# Altium project Mic2_WISP.PrjPCB
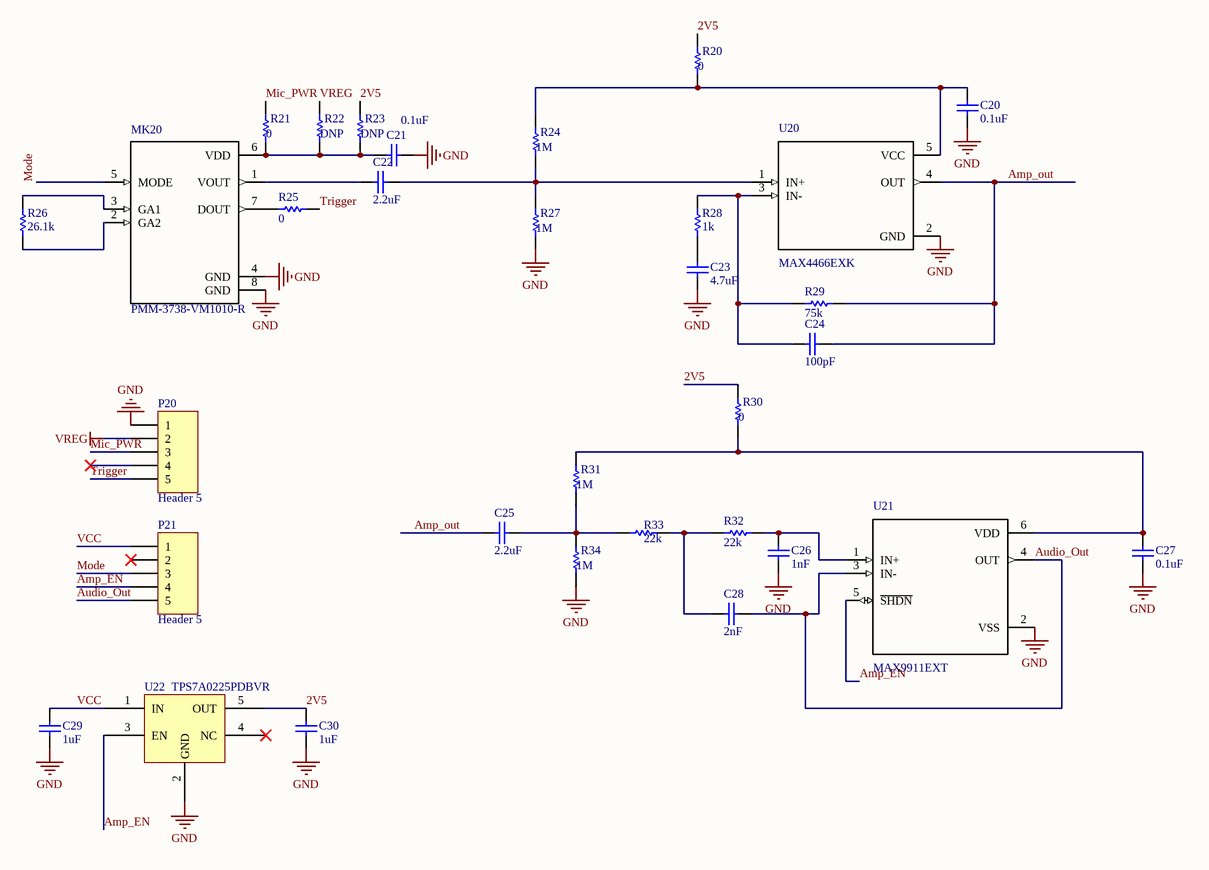
[diagram p0: Microphone2.SchDoc]
1 sheet, 32 parts. Net scope: global (net labels, ports and power ports of the same name join across sheets).
Board file: Microphone2.PcbDoc

## Sheet Microphone2.SchDoc: Microphone
size Letter; Author: Ali Saffari; Organization: University of Washinton; Address1: Sensor Systems Lab; Revision: 2; SheetNumber: 1; SheetTotal: 1

### Parts
C20  0.1uF  [0402]
C21  0.1uF  [0402]
C22  2.2uF  [0402]
C23  4.7uF  [0402]
C24  100pF  [0402]
C25  2.2uF  [0402]
C26  1nF  [0402]
C27  0.1uF  [0402]
C28  2nF  [0402]
C29  1uF  [0402]
C30  1uF  [0402]
MK20  PMM-3738-VM1010-R  [MIC_PMM-3738-VM1010-R]
P20  Header 5  [HDR1X5]
P21  Header 5  [HDR1X5]
R20  0  [0402]
R21  0  [0402]
R22  DNP  [0402]
R23  DNP  [0402]
R24  1M  [0402]
R25  0  [0402]
R26  26.1k  [0402]
R27  1M  [0402]
R28  1k  [0402]
R29  75k  [0402]
R30  0  [0402]
R31  1M  [0402]
R32  22k  [0402]
R33  22k  [0402]
R34  1M  [0402]
U20  MAX4466EXK  [SOT65P210X110-5N]
U21  MAX9911EXT  [MAX9911EXT]
U22  TPS7A0225PDBVR  [SOT23-5]

### Nets
GND: C20.2 C21.2 C23.1 C26.2 C27.1 C29.1 C30.1 MK20.4(GND) MK20.8(GND) P20.1 R27.2 R34.1 U20.2(GND) U21.2(VSS) U22.2(GND)
VREG: P20.2 R22.1
2V5: C30.2 R20.1 R23.1 R30.1 U22.5(OUT)
Amp_EN: P21.4 U21.5(~{SHDN}) U22.3(EN)
Amp_out: C24.1 C25.1 R29.2 U20.4(OUT)
Audio_Out: C28.1 P21.5 U21.3(IN-) U21.4(OUT)
Mic_PWR: P20.3 R21.1
Mode: MK20.5(MODE) P21.3
Trigger: P20.5 R25.2
VCC: C29.2 P21.1 U22.1(IN)
NetC20_1: C20.1 R20.2 R24.1 U20.5(VCC)
NetC21_1: C21.1 MK20.6(VDD) R21.2 R22.2 R23.2
NetC22_1: C22.1 MK20.1(VOUT)
NetC22_2: C22.2 R24.2 R27.1 U20.1(IN+)
NetC23_2: C23.2 R28.2
NetC24_2: C24.2 R28.1 R29.1 U20.3(IN-)
NetC25_2: C25.2 R31.1 R33.1 R34.2
NetC26_1: C26.1 R32.2 U21.1(IN+)
NetC27_2: C27.2 R30.2 R31.2 U21.6(VDD)
NetC28_2: C28.2 R32.1 R33.2
NetMK20_2: MK20.2(GA2) R26.2
NetMK20_3: MK20.3(GA1) R26.1
NetMK20_7: MK20.7(DOUT) R25.1

Not connected (* = marked no-connect by the designer): P20 4*; P21 2*; U22 4(NC)*

### Notes on the sheet
- Title
- Date:
- Project
- Revision:
- Sheet
- of
- Author:

### Library data of the parts
C20 C21 C27 = Cap: Ceramic Capacitor (Surface Mount); Manufacturer: Murata Electronics North America; Manufacturer Part Number: GCM155R71C104KA55D; Note: CAP CER 0.1UF 16V X7R 0402; Rating: 16V; Digi-Key Part Number: 490-4759-1-ND; Value: 0.1uF
C22 C25 C29 C30 = Cap: Ceramic Capacitor (Surface Mount); Manufacturer: Yageo; Manufacturer Part Number: RC0402JR-070RL; Digi-Key Part Number: 311-0.0JRCT-ND; Note: *; Rating: *
  C22 C25: Value: 2.2uF
  C29 C30: Value: 1uF
C23 = Cap: Ceramic Capacitor (Surface Mount); Manufacturer: Murata Electronics; Manufacturer Part Number: GRM155R61A475MEAAD; Note: CAP CER 4.7UF 10V X5R 0402; Rating: 10V; Digi-Key Part Number: 490-14306-1-ND; Value: 4.7uF
C24 = Cap: Ceramic Capacitor (Surface Mount); Manufacturer: Yageo; Manufacturer Part Number: CC0402JRNPO9BN101; Digi-Key Part Number: 311-1024-1-ND; Note: *; Rating: *; Value: 100pF
C26 = Cap: Ceramic Capacitor (Surface Mount); Manufacturer: Murata Electronics; Manufacturer Part Number: GCM155R71H102KA37D; Note: CAP CER 1000PF 50V X7R 0402; Rating: 50V; Digi-Key Part Number: 490-4761-1-ND; Value: 1nF
C28 = Cap: Ceramic Capacitor (Surface Mount); Manufacturer: AVX Corporation; Manufacturer Part Number: 04025C202JAT2A; Digi-Key Part Number: 478-10122-1-ND; Note: *; Rating: *; Value: 2nF
MK20 = PMM-3738-VM1010-R: MEMS Microphone Omni-Directional 700 Ohm -38dBV 1.8V Rectangular Solder Pad T/R; Manufacturer Part Number: VM1010; Manufacturer: Vesper Technologies Inc.; Notes: PIEZOELETRIC MEMS MIC SINGLE-END; Digi-Key Part Number: 2022-1001-1-ND
P20 P21 = Header 5: Header, 5-Pin; LatestRevisionDate: 17-Jul-2002; LatestRevisionNote: Re-released for DXP Platform.; Publisher: Altium Limited
R20-R23 R30 = Res: Chip Resistor (Surface Mount); Manufacturer: Yageo; Manufacturer Part Number: RC0402FR-071ML; Digi-Key Part Number: 311-1.00MLRCT-ND; Rating: *
  R20 R21 R30: Value: 0
  R22 R23: Value: DNP
R24 R27 R31 R34 = Res: Chip Resistor (Surface Mount); Manufacturer: Yageo; Manufacturer Part Number: RC0402FR-071ML; Value: DNP; Digi-Key Part Number: 311-1.00MLRCT-ND; Rating: *
R25 = Res: Chip Resistor (Surface Mount); Manufacturer: Yageo; Manufacturer Part Number: RC0402JR-070RL; Digi-Key Part Number: 311-0.0JRCT-ND; Rating: *; Value: 0
R26 = Res: Chip Resistor (Surface Mount); Manufacturer: Yageo; Manufacturer Part Number: RC0402FR-0726K1L; Digi-Key Part Number: 311-26.1KLRCT-ND; Rating: *; Value: 26.1k
R28 = Res: Chip Resistor (Surface Mount); Manufacturer: Yageo; Manufacturer Part Number: RC0402FR-071KL; Digi-Key Part Number: 311-1.00KLRCT-ND; Rating: *; Value: 1k
R29 = Res: Chip Resistor (Surface Mount); Manufacturer: Yageo; Manufacturer Part Number: RC0402FR-0775KL; Digi-Key Part Number: 311-75KLRCT-ND; Rating: *; Value: 75k
R32 R33 = Res: Chip Resistor (Surface Mount); Manufacturer: Yageo; Manufacturer Part Number: RT0402BRD0722KL; Digi-Key Part Number: YAG4210CT-ND; Rating: *; Value: 22k
U20 = MAX4466EXK: Audio Amp Microphone 1-CH Mono Class-AB 5-Pin SC70; Manufacturer: Maxim Integrated; Manufacturer Part Number: MAX4466EXK+T; Min Supply Voltage: 2.4V; Max Supply Voltage: 5.5V; Power Supply Rejection Ratio (PSRR): 112dB; Gain Bandwidth Product: 600kHz; Common Mode Rejection Ratio: 80dB; Max Power Dissipation: 200mW; Number of Channels: 1; Input Bias Current: 100nA; Input Offset Voltage (Vos): 5V; Supply Type: Single; Supplier 1: Digi-Key; Stock 1: 1912; Pricing 1: 1=0.86, 10=0.752, 25=0.7068, 100=0.5358, 250=0.456, 500=0.4332, 1000=0.3306 (USD); Mount: Surface Mount; Case/Package: SC; Number of Pins: 5; Weight: 0.000705oz; Contact Plating: Tin,Matte; Min Operating Temperature: -40°C; Max Operating Temperature: 85°C; Packaging: Tape and Reel; Package Quantity: 2500; Operating Supply Voltage: 5V; Length: 2mm; Height: 0.9mm; Width: 1.25mm; Radiation Hardening: No; REACH SVHC: Unknown; ComponentLink1URL: http://datasheets.maximintegrated.com/en/ds/MAX4465-MAX4469.pdf?src-supplier=Avnet; ComponentLink1Description: http://datasheets.maximintegrated.com/en/ds/MAX4465-MAX4469.pdf?src-supplier=Avnet; ComponentLink2URL: http://datasheets.maximintegrated.com/en/ds/MAX4465-MAX4469.pdf?src-supplier=Digi-Key; ComponentLink2Description: http://datasheets.maximintegrated.com/en/ds/MAX4465-MAX4469.pdf?src-supplier=Digi-Key; ComponentLink3URL: http://datasheets.maximintegrated.com/en/ds/MAX4465-MAX4469.pdf?src-supplier=Avnet+Europe; ComponentLink3Description: http://datasheets.maximintegrated.com/en/ds/MAX4465-MAX4469.pdf?src-supplier=Avnet+Europe; Supplier Part Number 1: MAX4466EXK+CT-ND
U21 = MAX9911EXT: Operational amplifier; 1.8Ã·5.5VDC; Channels: 1; SC70-6; Manufacturer Part Number: MAX9911EXT+T; Manufacturer: Maxim; Common Mode Rejection Ratio: 70dB; Number of Channels: 1; Output Current: 15mA; Slew Rate: 0.1V/µs; Nominal Supply Current: 4uA; Voltage Gain: 120dB; Min Supply Voltage: 1.8V; Max Supply Voltage: 5.5V; Bandwidth: 200kHz; Input Offset Voltage (Vos): 200uV; Input Bias Current: 1pA; Max Frequency: 1kHz; Max Power Dissipation: 245mW; Supplier 1: Digi-Key; Stock 1: 3380; Pricing 1: 1=1, 10=0.893, 25=0.848, 100=0.6511, 250=0.57536, 500=0.54508, 1000=0.51912 (USD); Mount: Surface Mount; Case/Package: SC; Number of Pins: 6; Contact Plating: Gold; Min Operating Temperature: -40°C; Max Operating Temperature: 85°C; Packaging: Tape and Reel; Package Quantity: 2500; Gain Bandwidth Product: 200kHz; Operating Supply Current: 4uA; Number of Circuits: 1; Output Current per Channel: 15mA; Number of Amplifiers: 1; Length: 2.15mm; Height: 1mm; Width: 1.35mm; Radiation Hardening: No; REACH SVHC: No SVHC; Lead Free: Lead Free; ComponentLink1URL: https://datasheets.maximintegrated.com/en/ds/MAX9910-MAX9913.pdf?src-supplier=Digi-Key; ComponentLink1Description: https://datasheets.maximintegrated.com/en/ds/MAX9910-MAX9913.pdf?src-supplier=Digi-Key; ComponentLink2URL: https://media.digikey.com/pdf/Data%20Sheets/Maxim%20PDFs/PartNumberBreakdown_ds.pdf?src-supplier=Digi-Key; ComponentLink2Description: https://media.digikey.com/pdf/Data%20Sheets/Maxim%20PDFs/PartNumberBreakdown_ds.pdf?src-supplier=Digi-Key; ComponentLink3URL: http://datasheets.maxim-ic.com/en/ds/MAX9910-MAX9913.pdf?src-supplier=Avnet+Europe; ComponentLink3Description: http://datasheets.maxim-ic.com/en/ds/MAX9910-MAX9913.pdf?src-supplier=Avnet+Europe; Supplier Part Number 1: MAX9911EXT+TCT-ND
U22 = TPS7A0218PDBVR: IC REG LINEAR 2.5V 200MA SOT23-5